# EAGLE design FYDE PCB Rough (EAGLE 9.0.1)

## Sheet 1 of 2
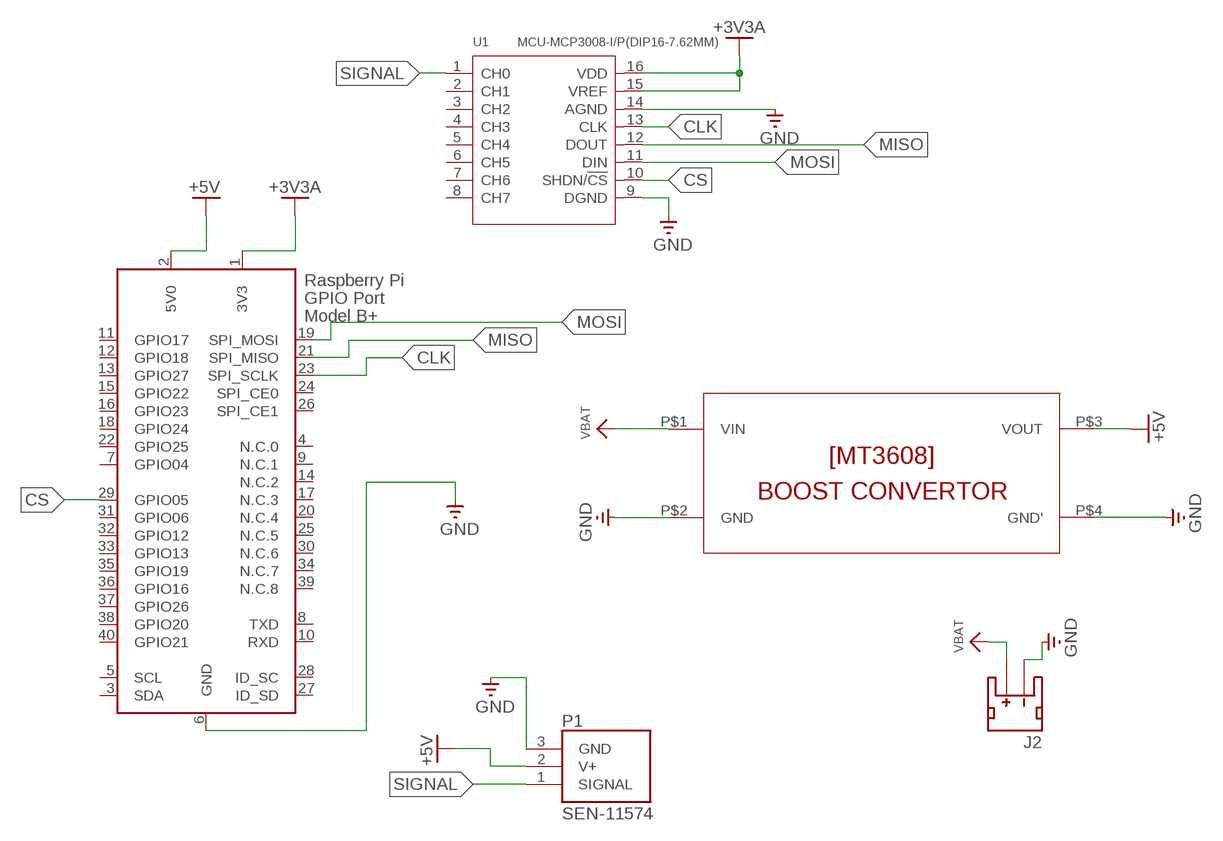
[diagram p0: schematic, sheet 1]

### Parts
J2  JST_2MM_MALE  [JST-2-SMD]
P1  SEN-11574  [XDCR_SEN-11574]
U1  MCU-MCP3008-I/P(DIP16-7.62MM)  [DIP16-2.54-19.2X7.62MM]
U$2  MT3608  [MT3608]
X1  RASPI_BOARD_B+_HDC  [RASPI_BOARD_B+HAT_DF_CF]

### Nets
+3V3A: U1.15(VREF) U1.16(VDD) X1.1(3V3)
+5V: P1.2(V+) U$2.P$3(VOUT) X1.2(5V0)
CLK: U1.13(CLK) X1.23(SPI_SCLK)
CS: U1.10(SHDN/!CS) X1.29(GPIO05)
GND: J2.1(-) P1.3(GND) U1.9(DGND) U1.14(AGND) U$2.P$2(GND) U$2.P$4(GND') X1.6(GND)
MISO: U1.12(DOUT) X1.21(SPI_MISO)
MOSI: U1.11(DIN) X1.19(SPI_MOSI)
SIGNAL: P1.1(SIGNAL) U1.1(CH0)
VBAT: J2.2(+) U$2.P$1(VIN)
Unconnected: J2.NC1(PAD1) J2.NC2(PAD2) U1.2(CH1) U1.3(CH2) U1.4(CH3) U1.5(CH4) U1.6(CH5) U1.7(CH6) U1.8(CH7) X1.3(SDA) X1.4(N.C.0) X1.5(SCL) X1.7(GPIO04) X1.8(TXD) X1.9(N.C.1) X1.10(RXD) X1.11(GPIO17) X1.12(GPIO18) X1.13(GPIO27) X1.14(N.C.2) X1.15(GPIO22) X1.16(GPIO23) X1.17(N.C.3) X1.18(GPIO24) X1.20(N.C.4) X1.22(GPIO25) X1.24(SPI_CE0) X1.25(N.C.5) X1.26(SPI_CE1) X1.27(ID_SD) X1.28(ID_SC) X1.30(N.C.6) X1.31(GPIO06) X1.32(GPIO12) X1.33(GPIO13) X1.34(N.C.7) X1.35(GPIO19) X1.36(GPIO16) X1.37(GPIO26) X1.38(GPIO20) X1.39(N.C.8) X1.40(GPIO21)

## Sheet 2 of 2

## Library data of the parts
J2 = SparkFun-Connectors:JST_2MM_MALE: JST 2MM MALE RA CONNECTOR Two pin, compact surface mount connector. Commonly used as a battery input connection point. We really like the solid locking feeling and high current rating on these small connectors. We use these all the time as battery connectors. Mates to single-cell LiPo batteries. Here is the connector we sell at SparkFun: JST Right Angle Connector - White <https://www.sparkfun.com/products/8612> (PRT-08612) Datasheet <http://www.sparkfun.com/datasheets/Prototyping/Connectors/JST-Horizontal.pdf> It was used on these SparkFun products: SparkFun MOSFET Power Controller <https://www.sparkfun.com/products/11214> (PRT-11214) SparkFun Battery Babysitter - LiPo Battery Manager <https://www.sparkfun.com/products/13777> (PRT-13777) And many, many others that required a lipo battery connection.; PROD_ID: CONN-11443; SF_ID: PRT-08612
P1 = SEN-11574:SEN-11574: Pulse Sensor For Arduino; AVAILABILITY: Unavailable; DESCRIPTION: PULSE SENSOR FOR ARDUINO; MF: SparkFun; MP: SEN-11574; PACKAGE: None; PRICE: None
U1 = MCU-MCP3008-I_P_DIP16-7.62MM_:MCU-MCP3008-I/P(DIP16-7.62MM): 310990040; AVAILABILITY: Unavailable; DESCRIPTION: 10 Bit Analog to Digital Converter 4, 8 Input 1 SAR 16-PDIP; MF: Microchip; MP: MCP3008-I/P; PACKAGE: DIP-16 Microchip; PRICE: None
U$2 = MT3608:MT3608
X1 = raspberrypi_bastelstube_v13:RASPI_BOARD_B+: Raspberry Pi GPIO connector with markings for the outer dimensions of the Raspberry Pi board model B+ with different sets of drill holes or mounting pads

## Board
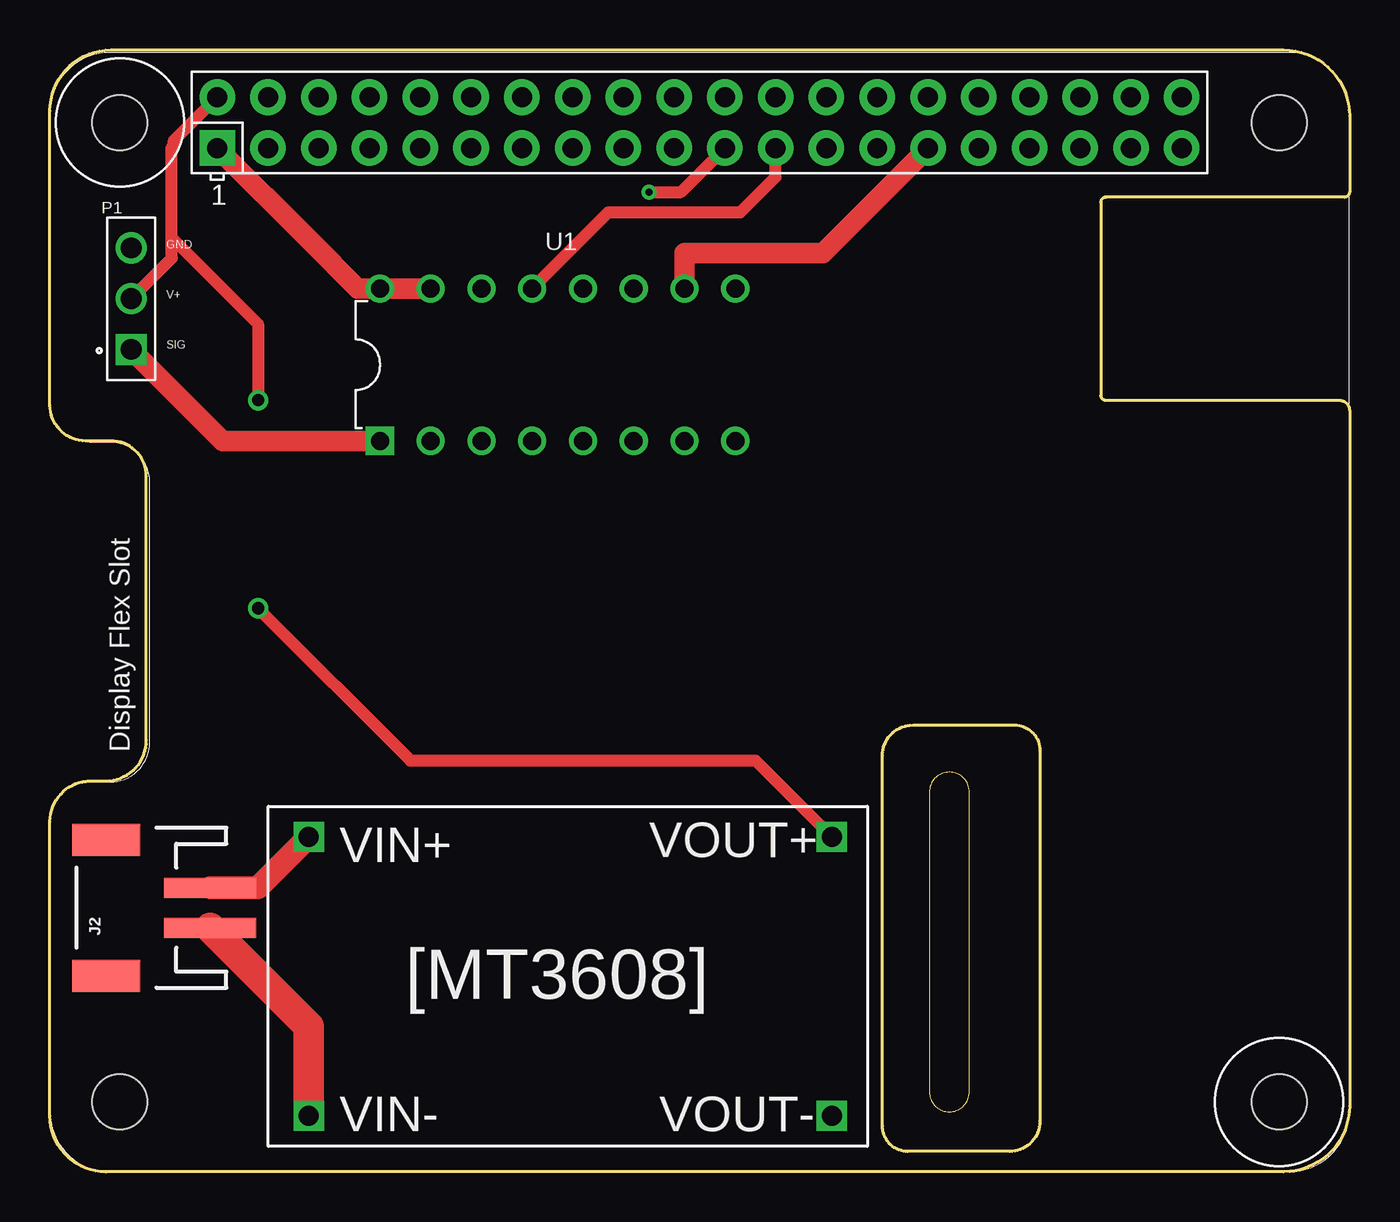
[diagram p1: board, top side]
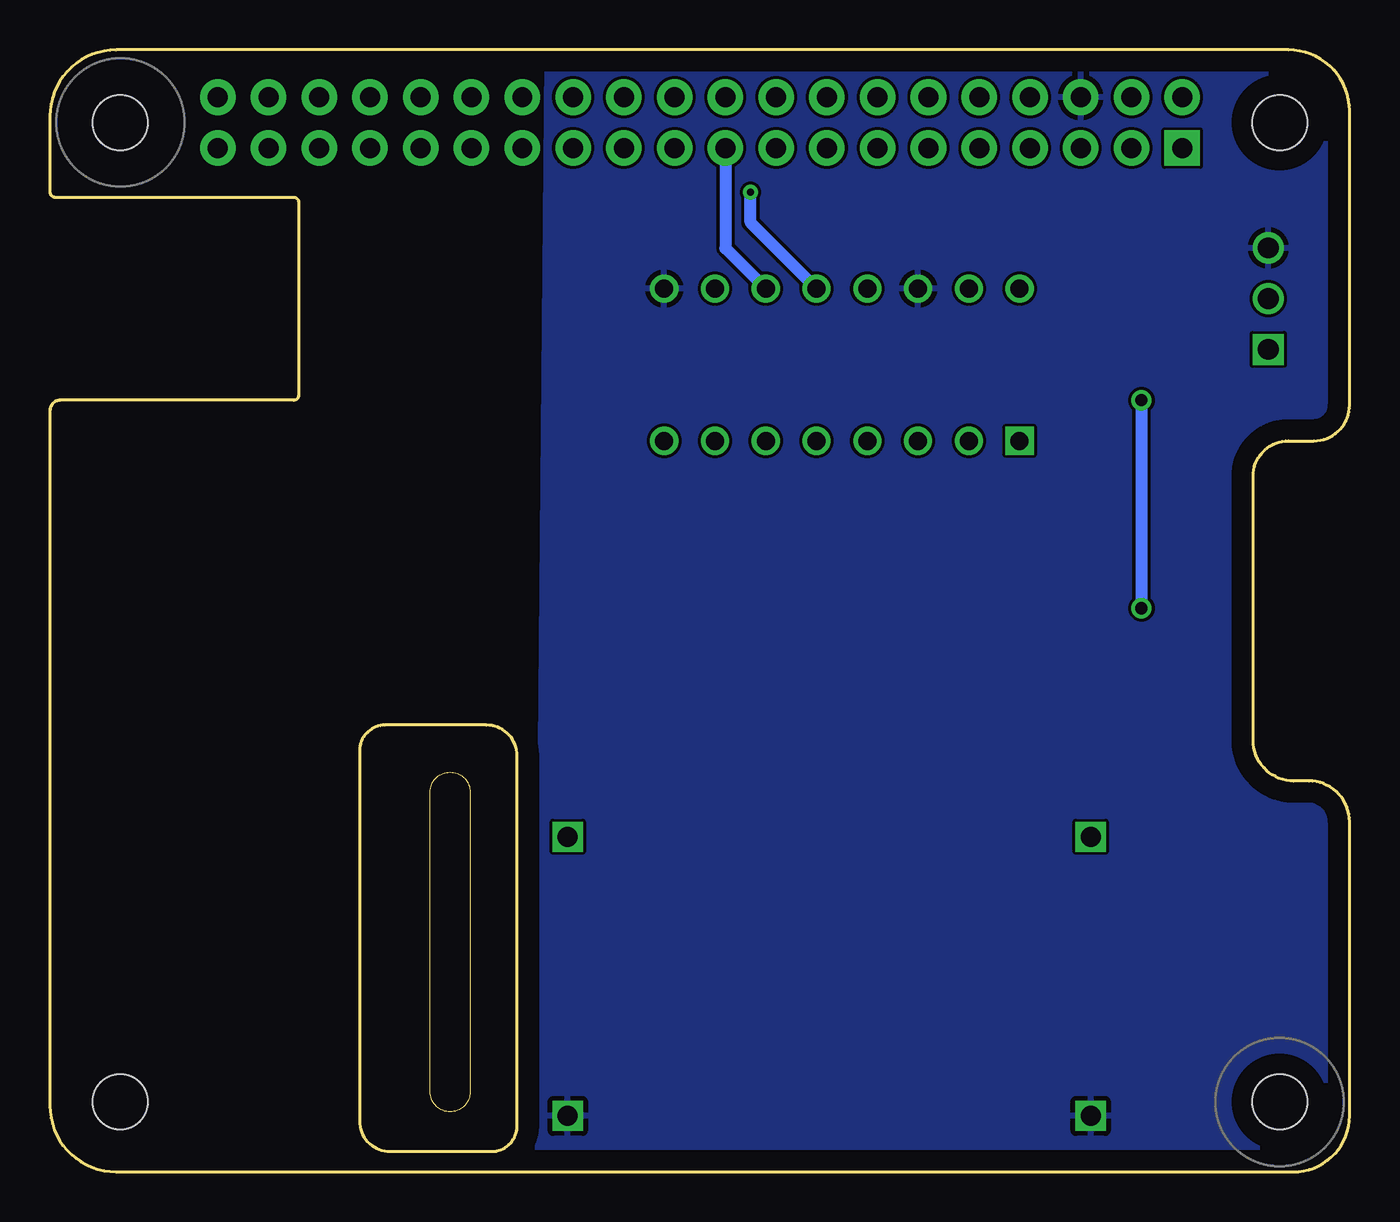
[diagram p2: board, bottom side, seen from below]

Size 65.02 x 56.13 mm. Coordinates in mm from the lower left corner, seen from the top.
Outline: 0,53.09 arc-90 3.05,56.13 61.72,56.13 arc-90 65.02,52.83 65.02,49.02 arc-90 64.77,48.77 52.83,48.77 arc90 52.58,48.51 52.58,38.86 arc90 52.83,38.61 64.52,38.61 arc-90 65.02,38.1 65.02,3.3 arc-90 61.72,0 2.79,0 arc-90 0,2.79 0,17.53 arc-90 2.03,19.56 2.79,19.56 arc90 4.83,21.59 4.83,34.8 arc90 3.05,36.58 1.78,36.58 arc-90 0,38.35 0,53.09
Outline: 41.66,2.29 41.66,20.83 arc-90 43.18,22.35 48.26,22.35 arc-90 49.53,21.08 49.53,2.54 arc-90 48.01,1.02 42.93,1.02 arc-90 41.66,2.29
Copper layers (1*16): Top 0.035mm / dielectric 1.5mm / Bottom 0.035mm
Design rules "default": minimum track width 6mil, minimum drill 0.35mm, track to track 6mil, track to pad 6mil, pad to pad 6mil, via to via 6mil, smd to smd 6mil, copper to edge 40mil, drill to drill 6mil, minimum pad ring 10mil, minimum via ring 8mil, stop-mask expansion 4mil, vias tented up to drill 0mil, thermal gap 10mil

### Footprints (pad centres in the part's own frame; a part is rotated, then mirrored left to right if it is on the bottom)
JST-2-SMD = smd 1 x 4.6: 1 -1,-3.7; 2 1,-3.7 | smd 1.6 x 3.4: NC1 -3.4,1.5; NC2 3.4,1.5
XDCR_SEN-11574 = drill 1.04 square: 1 0,-2.54 | drill 1.04: 2 0,0; 3 0,2.54
DIP16-2.54-19.2X7.62MM = drill 0.9 pad 1.4 square: 1 -8.89,-3.81 | drill 0.9 pad 1.4: 2 -6.35,-3.81; 3 -3.81,-3.81; 4 -1.27,-3.81; 5 1.27,-3.81; 6 3.81,-3.81; 7 6.35,-3.81; 8 8.89,-3.81; 9 8.89,3.81; 10 6.35,3.81; 11 3.81,3.81; 12 1.27,3.81; 13 -1.27,3.81; 14 -3.81,3.81; 15 -6.35,3.81; 16 -8.89,3.81
MT3608 = drill 1 square: P$1 2.032,15.494; P$2 2.032,1.524; P$3 28.194,15.494; P$4 28.194,1.524
RASPI_BOARD_B+HAT_DF_CF = drill 1 pad 1.778 square: 1 8.37,51.23 | drill 1 pad 1.778: 2 8.37,53.77; 3 10.91,51.23; 4 10.91,53.77; 5 13.45,51.23; 6 13.45,53.77; 7 15.99,51.23; 8 15.99,53.77; 9 18.53,51.23; 10 18.53,53.77; 11 21.07,51.23; 12 21.07,53.77; 13 23.61,51.23; 14 23.61,53.77; 15 26.15,51.23; 16 26.15,53.77; 17 28.69,51.23; 18 28.69,53.77; 19 31.23,51.23; 20 31.23,53.77; 21 33.77,51.23; 22 33.77,53.77; 23 36.31,51.23; 24 36.31,53.77; 25 38.85,51.23; 26 38.85,53.77; 27 41.39,51.23; 28 41.39,53.77; 29 43.93,51.23; 30 43.93,53.77; 31 46.47,51.23; 32 46.47,53.77; 33 49.01,51.23; 34 49.01,53.77; 35 51.55,51.23; 36 51.55,53.77; 37 54.09,51.23; 38 54.09,53.77; 39 56.63,51.23; 40 56.63,53.77 | hole 2.75: 3.5,3.5; 3.5,52.5; 61.5,3.5; 61.5,52.5

### Placement (x,y rotation side)
J2  4.32,13.21 90 top
P1  4.06,43.69 0 top
U1  25.4,40.39 0 top
U$2  10.92,1.27 0 top
X1  0,0 0 top

### Tracks (layer width: path | path; a pad name or v marks a point on that pad's centre or on a via)
+3V3A
  Top 1.016: X1.1 13.04,46.56 15.4,44.2 U1.16 U1.15
+5V  (via drill 0.61)
  Top 0.61: P1.2 6.1,45.72 6.1,46.74 | X1.2 6.2,51.6 6.2,51.38 6.1,51.28 6.1,46.74 | 6.1,46.74 10.41,42.42 v10.41,38.61 | v10.41,28.19 18.03,20.57 32.26,20.57 35.31,20.57 U$2.P$3
  Bottom 0.61: v10.41,38.61 v10.41,28.19
CLK
  Top 0.61: U1.13 27.94,48.01 34.54,48.01 36.31,49.77 X1.23
CS
  Top 1.016: X1.29 38.67,45.97 31.75,45.97 U1.10
GND
  Top 1.524: J2.1 12.95,7.27 U$2.P$2
  pour Bottom: 0.51,55.63 1.02,0 40.64,0 40.13,55.63
MISO  (via drill 0.35)
  Top 0.61: v29.97,49.02 31.56,49.02 X1.21
  Bottom 0.61: U1.12 29.97,47.5 v29.97,49.02
MOSI
  Bottom 0.61: X1.19 31.23,46.22 U1.11
SIGNAL
  Top 1.016: P1.1 8.64,36.58 U1.1
VBAT
  Top 1.143: U$2.P$1 10.4,14.21 J2.2